# Altium schematic sheet DC-DC.SchDoc
size A4
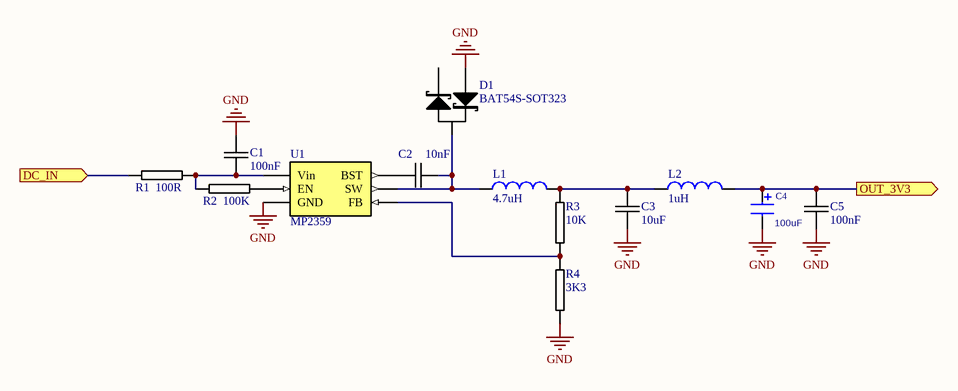
[diagram p0: DC-DC.SchDoc]

## Parts
C1  100nF  [0603C-GENERIC]
C2  10nF  [0603C-GENERIC]
C3  10uF  [0805C-GENERIC]
C4  100uF  [CPM7343]
C5  100nF  [0603C-GENERIC]
D1  BAT54S-SOT323  [SOT323-123]
L1  Inductance: 4.7uH  [C_1210]  (hidden comment: IND)
L2  Inductance: 1uH  [C_1206]  (hidden comment: IND)
R1  100R  [0603R-100]
R2  100K  [0603R-100K]
R3  10K  [0603R-10K]
R4  3K3  [0603R-GENERIC]
U1  MP2359  [TSOP23-6]

## Ports
DC_IN (in), OUT_3V3 (out)

## Nets
GND: C1.1 C3.2 C4.2 C5.2 D1.1 R4.2 U1.2(GND)
DC_IN: R1.1 ; port DC_IN
OUT_3V3: C4.1 C5.1 L2.2 ; port OUT_3V3
NetC1_2: C1.2 R1.2 R2.1 U1.5(Vin)
NetC2_1: C2.1 U1.1(BST)
NetC2_2: C2.2 D1.3 L1.1 U1.6(SW)
NetC3_1: C3.1 L1.2 L2.1 R3.1
NetR2_2: R2.2 U1.4(EN)
NetR3_2: R3.2 R4.1 U1.3(FB)

Not connected (* = marked no-connect by the designer): D1 2

## Library data of the parts
C1 C5 = 0603C-100NF-25V-X7R-TDK: CAPACITOR 0603 CERAMIC; Manufacturer Part Number: C1608X7R1E104K; Manufacturer: TDK Corporation; Reel: C12; Supplier 1: Digi-Key; Supplier Part Number 1: 445-1316-2-ND
C2 = 0603C-10NF-50V-X7R-MUR: CAPACITOR 0603 CERAMIC; Manufacturer Part Number: GRM188R71H103KA01D; Manufacturer: Murata Electronics North America; Reel: C22; Supplier 1: Digi-Key; Supplier Part Number 1: 490-1512-2-ND
C3 = 0805C-10UF-6V3-X5R-PAN: CAPACITOR 0805 CERAMIC; Manufacturer: Panasonic - ECG; Manufacturer Part Number: ECJ-2FB0J106M; Reel: C1; Capacitance: 10µF; Voltage - Rated: 6.3V; Temperature Coefficient: X5R; Tolerance: ±20%; Supplier 1: Digi-Key; Supplier Part Number 1: PCC2225TR-ND; Supplier: Digi-Key; Operating Temperature: -55°C ~ 85°C; Mounting Type: Surface Mount, MLCC; Lead Spacing: -; RoHS: RoHS Compliant; Packaging: Tape & Reel (TR); Thickness: 1.25mm; Package / Case: 0805 (2012 metric); Features: General Purpose; Category: Capacitors; Supplier Part Number: PCC2225TR-ND
C4 = CPM7343: Capacitor; Value: {Value}
D1 = BAT54S-SOT323: DUAL SCHOTTKY DIODE SERIES; Manufacturer: NXP Semiconductors; Manufacturer Part Number: BAT54SW,115; Voltage - Forward (Vf) (Max) @ If: 800mV @ 100mA; Current - Reverse Leakage @ Vr: 2µA @ 25V; Speed: Small Signal =< 200mA (Io), Any Speed; Diode Configuration: 1 Pair Series Connection; Current - Average Rectified (Io) (per Diode): 200mA (DC); Voltage - DC Reverse (Vr) (Max): 30V; Reverse Recovery Time (trr): 5ns; Supplier 1: Digi-Key; Supplier Part Number 1: 568-1615-2-ND; Mounting Type: Surface Mount; Packaging: Tape & Reel (TR); Package / Case: SC-70-3, SOT-323-3; Diode Type: Schottky; Supplier Part Number: 568-1615-2-ND; Category: Discrete Semiconductor Products; Supplier: Digi-Key; RoHS: RoHS Compliant
L1 L2 = Inductor
R1 = 0603R-100: GENERIC RESISTOR 0603; Manufacturer Part Number: RMCF 1/16 100 1% R; Manufacturer: Stackpole Electronics Inc; Reel: R24; Supplier 1: Digi-Key; Supplier Part Number 1: RMCF1/16100FRDKR-ND
R2 = 0603R-100K: GENERIC RESISTOR 0603; Manufacturer Part Number: RMCF 1/16 100K 1% R; Manufacturer: Stackpole Electronics Inc; Tolerance: ±1%; Power (Watts): 0.1W, 1/10W; Temperature Coefficient: ±100ppm/°C; REEL: R47; Case: 0603 (1608 metric); Resistance In Ohms: 100K; RoHS: RoHS Compliant; Composition: Thick Film; Lead Style: Surface Mount (SMD - SMT); Supplier: Digi-Key; Supplier Part Number: RMCF1/16100KFRCT-ND; Category: Resistors; Packaging: Cut Tape (CT); Supplier 1: Digi-Key; Supplier Part Number 1: RMCF0603FT100KTR-ND
R3 = 0603R-10K: GENERIC RESISTOR 0603; Manufacturer: Stackpole Electronics Inc; Manufacturer Part Number: RMCF 1/16 10K 1% R; Tolerance: ±1%; Power (Watts): 0.1W, 1/10W; Temperature Coefficient: ±100ppm/°C; Resistance In Ohms: 10.0K; Reel: R21; Category: Resistors; Supplier Part Number: RMCF1/1610KFRDKR-ND; Lead Style: Surface Mount (SMD - SMT); RoHS: RoHS Compliant; Packaging: Digi-Reel®; Case: 0603 (1608 metric); Composition: Thick Film; Supplier: Digi-Key; Supplier 1: Digi-Key; Supplier Part Number 1: RMCF0603FT10K0DKR-ND
R4 = 0603R-3K3: GENERIC RESISTOR 0603; Supplier 1: Digi-Key; Supplier Part Number 1: RMCF0603FT3K30CT-ND
U1 = MP2359: monolithic step-down switch  mode converter with a built-in power MOSFET; Supply Voltage VIN: 4.5V - 24V; Output Voltage VOUT: 0.81V to 15V; Peak Output Current: 1.2A; Frequency: 1.4MHz